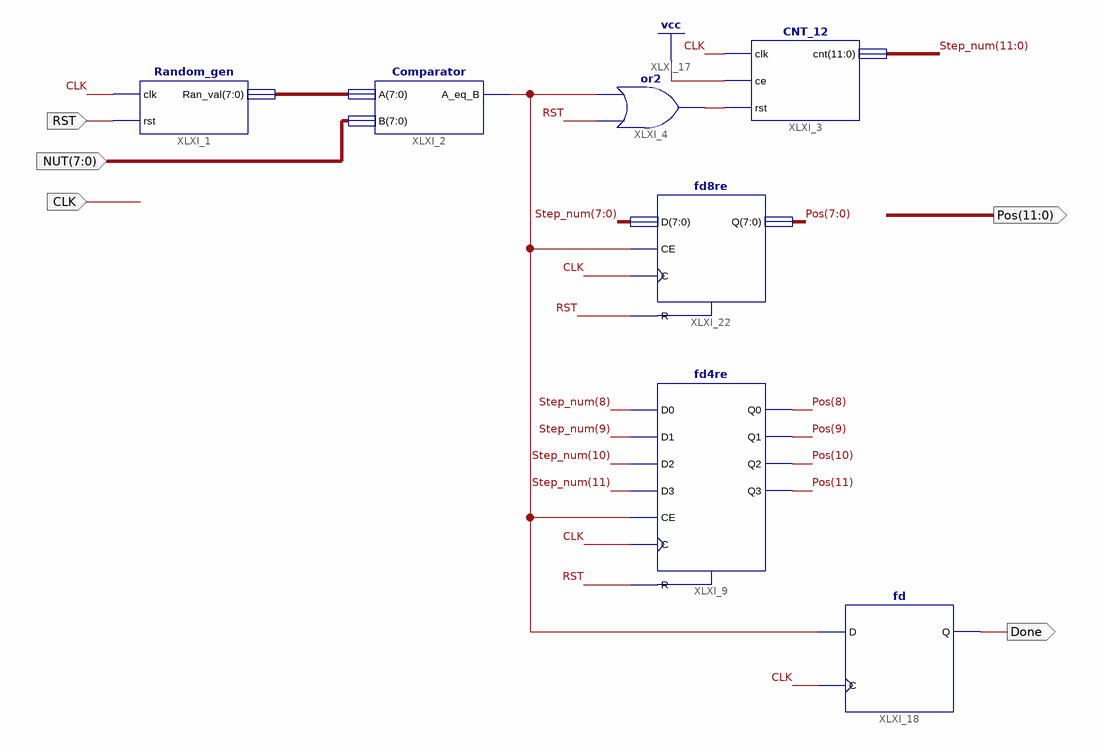
[diagram p0: schematic sheet 1]
// Xilinx ISE schematic Ran_Num_Dec.sch (spartan6) as structural Verilog: 7 symbols, 5 ports
module Ran_Num_Dec (
  input  CLK,
  input  RST,
  input  [7:0] NUT,
  output [11:0] Pos,
  output Done
);

  wire eq, XLXN_6;
  wire [7:0] XLXN_1;
  wire [11:0] Step_num;

  Random_gen XLXI_1 (.clk(CLK), .rst(RST), .Ran_val(XLXN_1));
  Comparator XLXI_2 (.A(XLXN_1), .B(NUT), .A_eq_B(eq));
  or XLXI_4 (XLXN_6, RST, eq);
  CNT_12 XLXI_3 (.clk(CLK), .ce(1'b1), .rst(XLXN_6), .cnt(Step_num));
  fd8re XLXI_22 (.C(CLK), .CE(eq), .D(Step_num[7:0]), .R(RST), .Q(Pos[7:0]));
  fd4re XLXI_9 (
    .C(CLK), .CE(eq), .D0(Step_num[8]), .D1(Step_num[9]), .D2(Step_num[10]), .D3(Step_num[11]), .R(RST),
    .Q0(Pos[8]), .Q1(Pos[9]), .Q2(Pos[10]), .Q3(Pos[11]));
  fd XLXI_18 (.C(CLK), .D(eq), .Q(Done));
endmodule
